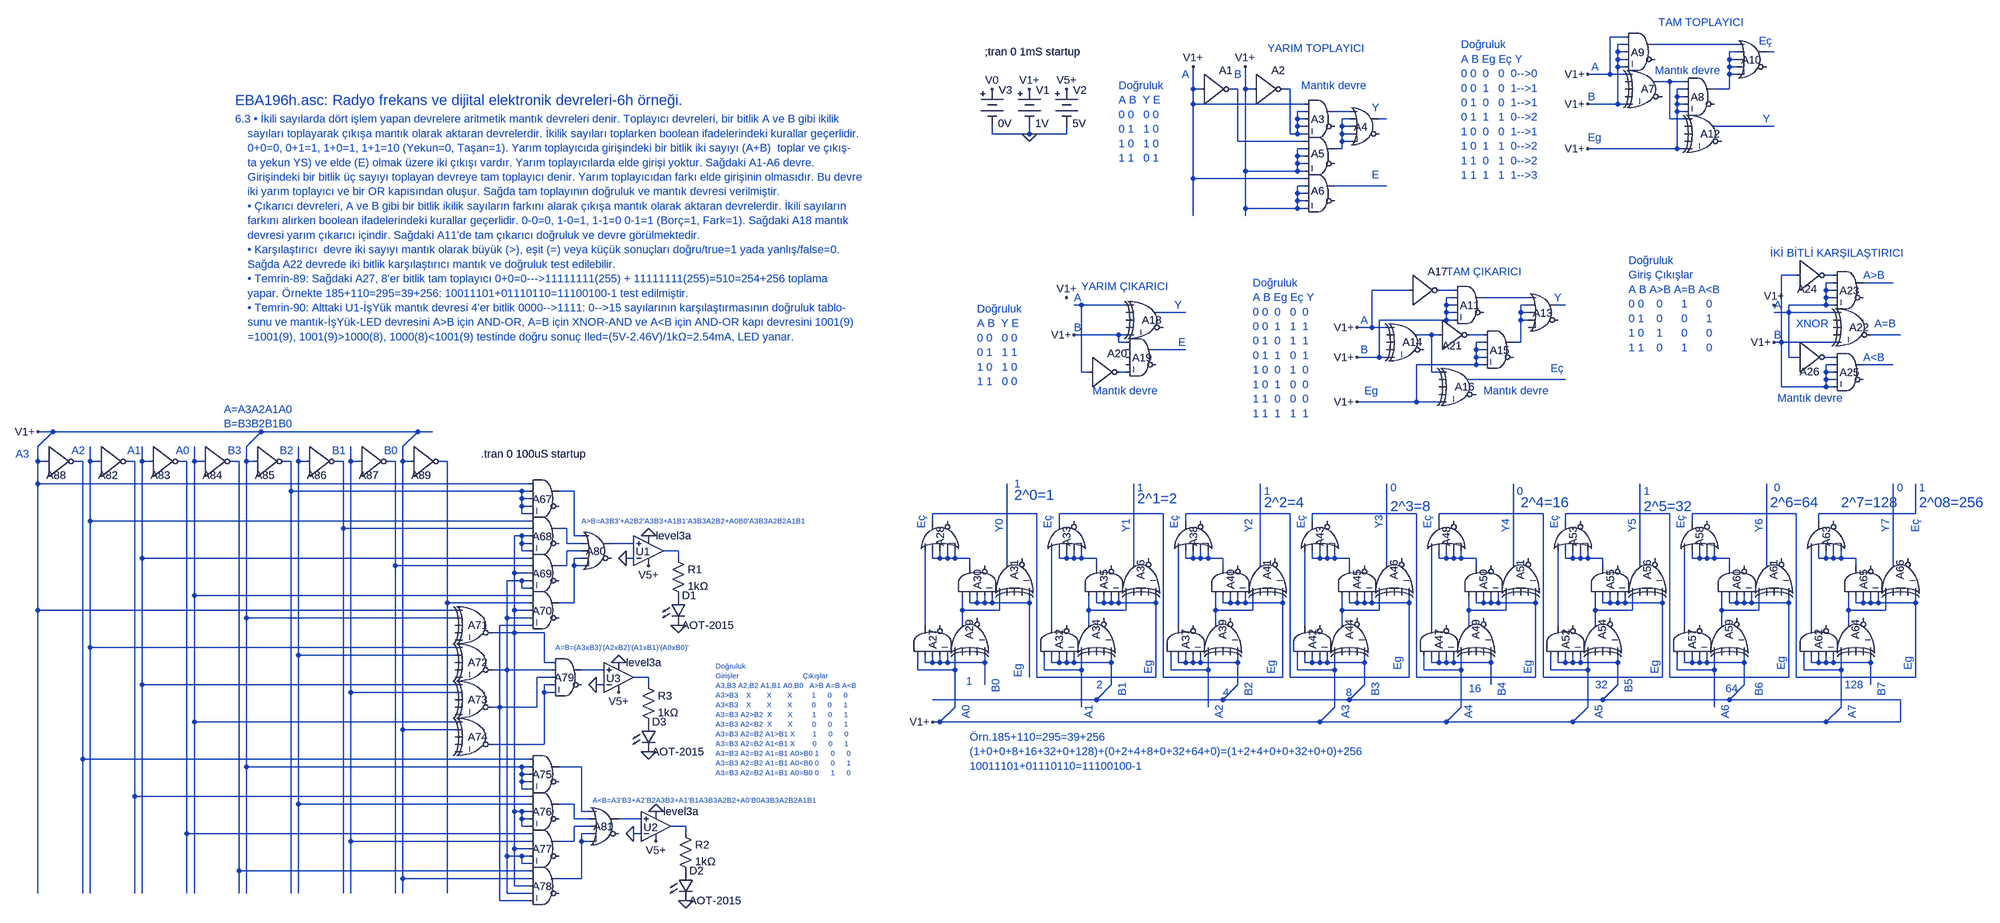
[diagram p0: schematic EBA196h.asc]
EBA196h.asc, the LTspice schematic file:
Version 4
SHEET 1 7064 4332
WIRE 2896 -80 2864 -80
WIRE 2896 -64 2880 -64
WIRE 3136 -64 2960 -64
WIRE 2880 -48 2880 -64
WIRE 2896 -48 2880 -48
WIRE 3136 -48 3120 -48
WIRE 3216 -48 3200 -48
WIRE 2880 -32 2880 -48
WIRE 2896 -32 2880 -32
WIRE 3120 -32 3120 -48
WIRE 3136 -32 3120 -32
WIRE 2880 -16 2880 -32
WIRE 2896 -16 2880 -16
WIRE 3120 -16 3120 -32
WIRE 3136 -16 3120 -16
WIRE 2864 0 2864 -80
WIRE 2864 0 2816 0
WIRE 2896 0 2864 0
WIRE 3120 0 3120 -16
WIRE 3136 0 3120 0
WIRE 2992 16 2960 16
WIRE 3024 16 2992 16
WIRE 1968 32 1968 -16
WIRE 1984 32 1968 32
WIRE 2064 32 2048 32
WIRE 2080 32 2080 -16
WIRE 2096 32 2080 32
WIRE 2176 32 2160 32
WIRE 3024 32 3008 32
WIRE 3120 32 3120 0
WIRE 3120 32 3088 32
WIRE 3008 48 3008 32
WIRE 3024 48 3008 48
WIRE 1968 64 1968 32
WIRE 2208 64 1968 64
WIRE 2880 64 2880 -16
WIRE 2880 64 2816 64
WIRE 2896 64 2880 64
WIRE 3008 64 3008 48
WIRE 3024 64 3008 64
WIRE 2208 80 2192 80
WIRE 2304 80 2272 80
WIRE 3008 80 3008 64
WIRE 3024 80 3008 80
WIRE 2192 96 2192 80
WIRE 2208 96 2192 96
WIRE 2304 96 2288 96
WIRE 2384 96 2368 96
WIRE 2992 96 2992 16
WIRE 3024 96 2992 96
WIRE 2192 112 2192 96
WIRE 2208 112 2192 112
WIRE 2288 112 2288 96
WIRE 2304 112 2288 112
WIRE 3216 112 3088 112
WIRE 1536 128 1536 112
WIRE 1616 128 1616 112
WIRE 1616 128 1536 128
WIRE 1696 128 1696 112
WIRE 1696 128 1616 128
WIRE 2176 128 2176 32
WIRE 2192 128 2192 112
WIRE 2192 128 2176 128
WIRE 2208 128 2192 128
WIRE 2288 128 2288 112
WIRE 2304 128 2288 128
WIRE 2064 144 2064 32
WIRE 2208 144 2064 144
WIRE 2288 144 2288 128
WIRE 2304 144 2288 144
WIRE 2208 160 2192 160
WIRE 2288 160 2288 144
WIRE 2288 160 2272 160
WIRE 3008 160 3008 80
WIRE 3008 160 2816 160
WIRE 3024 160 3008 160
WIRE 2192 176 2192 160
WIRE 2208 176 2192 176
WIRE 2192 192 2192 176
WIRE 2208 192 2192 192
WIRE 2080 208 2080 32
WIRE 2192 208 2192 192
WIRE 2192 208 2080 208
WIRE 2208 208 2192 208
WIRE 1968 224 1968 64
WIRE 2208 224 1968 224
WIRE 2208 240 2192 240
WIRE 2384 240 2272 240
WIRE 2192 256 2192 240
WIRE 2208 256 2192 256
WIRE 2192 272 2192 256
WIRE 2208 272 2192 272
WIRE 2080 288 2080 208
WIRE 2192 288 2192 272
WIRE 2192 288 2080 288
WIRE 2208 288 2192 288
WIRE 1968 304 1968 224
WIRE 2080 304 2080 288
WIRE 3264 432 3232 432
WIRE 3344 432 3328 432
WIRE 3344 448 3328 448
WIRE 3472 448 3408 448
WIRE 2432 464 2352 464
WIRE 2528 464 2496 464
WIRE 3328 464 3328 448
WIRE 3344 464 3328 464
WIRE 2528 480 2512 480
WIRE 2688 480 2592 480
WIRE 3328 480 3328 464
WIRE 3344 480 3328 480
WIRE 1728 496 1712 496
WIRE 1824 496 1728 496
WIRE 2512 496 2512 480
WIRE 2528 496 2512 496
WIRE 2688 496 2672 496
WIRE 2768 496 2752 496
WIRE 3328 496 3328 480
WIRE 3328 496 3248 496
WIRE 3344 496 3328 496
WIRE 1952 512 1888 512
WIRE 2512 512 2512 496
WIRE 2528 512 2512 512
WIRE 2672 512 2672 496
WIRE 2688 512 2672 512
WIRE 3248 512 3248 496
WIRE 3248 512 3216 512
WIRE 3344 512 3248 512
WIRE 2512 528 2512 512
WIRE 2512 528 2368 528
WIRE 2528 528 2512 528
WIRE 2672 528 2672 512
WIRE 2688 528 2672 528
WIRE 2352 544 2352 464
WIRE 2352 544 2320 544
WIRE 2384 544 2352 544
WIRE 1808 560 1712 560
WIRE 1824 560 1808 560
WIRE 2480 560 2448 560
WIRE 2496 560 2480 560
WIRE 2592 560 2560 560
WIRE 3488 560 3424 560
WIRE 1808 576 1808 560
WIRE 1824 576 1808 576
WIRE 2592 576 2576 576
WIRE 2672 576 2672 528
WIRE 2672 576 2656 576
WIRE 3232 576 3232 432
WIRE 3232 576 3216 576
WIRE 3344 576 3232 576
WIRE 1952 592 1888 592
WIRE 2576 592 2576 576
WIRE 2592 592 2576 592
WIRE 2368 608 2368 528
WIRE 2368 608 2320 608
WIRE 2384 608 2368 608
WIRE 2576 608 2576 592
WIRE 2592 608 2576 608
WIRE 3248 608 3248 512
WIRE 3264 608 3248 608
WIRE 3344 608 3328 608
WIRE 2576 624 2576 608
WIRE 2576 624 2448 624
WIRE 2592 624 2576 624
WIRE 3344 624 3328 624
WIRE 3472 624 3408 624
WIRE 1728 640 1728 496
WIRE 1744 640 1728 640
WIRE 1824 640 1808 640
WIRE 2480 640 2480 560
WIRE 2496 640 2480 640
WIRE 3328 640 3328 624
WIRE 3344 640 3328 640
WIRE 2768 656 2560 656
WIRE 3328 656 3328 640
WIRE 3344 656 3328 656
WIRE 3232 672 3232 576
WIRE 3328 672 3328 656
WIRE 3328 672 3232 672
WIRE 3344 672 3328 672
WIRE 2448 704 2448 624
WIRE 2448 704 2320 704
WIRE 2496 704 2448 704
WIRE -624 768 -656 768
WIRE -176 768 -624 768
WIRE 160 768 -176 768
WIRE 192 768 160 768
WIRE -656 800 -624 768
WIRE -208 800 -176 768
WIRE 128 800 160 768
WIRE -656 832 -656 800
WIRE -640 832 -656 832
WIRE -560 832 -576 832
WIRE -544 832 -544 800
WIRE -528 832 -544 832
WIRE -448 832 -464 832
WIRE -432 832 -432 800
WIRE -416 832 -432 832
WIRE -336 832 -352 832
WIRE -320 832 -320 800
WIRE -304 832 -320 832
WIRE -224 832 -240 832
WIRE -208 832 -208 800
WIRE -192 832 -208 832
WIRE -112 832 -128 832
WIRE -96 832 -96 800
WIRE -80 832 -96 832
WIRE 0 832 -16 832
WIRE 16 832 16 800
WIRE 32 832 16 832
WIRE 112 832 96 832
WIRE 128 832 128 800
WIRE 144 832 128 832
WIRE 224 832 208 832
WIRE -656 880 -656 832
WIRE 400 880 -656 880
WIRE -112 896 -112 832
WIRE 384 896 -112 896
WIRE 400 896 384 896
WIRE 496 896 464 896
WIRE 384 912 384 896
WIRE 400 912 384 912
WIRE 384 928 384 912
WIRE 400 928 384 928
WIRE 384 944 384 928
WIRE 400 944 384 944
WIRE 1632 944 1408 944
WIRE 1904 944 1680 944
WIRE 2176 944 1952 944
WIRE 2448 944 2224 944
WIRE 2720 944 2496 944
WIRE 2992 944 2768 944
WIRE 3264 944 3040 944
WIRE 3520 944 3520 880
WIRE 3520 944 3312 944
WIRE -544 960 -544 832
WIRE 400 960 -544 960
WIRE 1408 960 1408 944
WIRE 1680 960 1680 944
WIRE 1952 960 1952 944
WIRE 2224 960 2224 944
WIRE 2496 960 2496 944
WIRE 2768 960 2768 944
WIRE 3040 960 3040 944
WIRE 3312 960 3312 944
WIRE 0 976 0 832
WIRE 400 976 0 976
WIRE 480 976 464 976
WIRE 384 992 368 992
WIRE 400 992 384 992
WIRE 496 992 496 896
WIRE 512 992 496 992
WIRE 384 1008 384 992
WIRE 400 1008 384 1008
WIRE 480 1008 480 976
WIRE 512 1008 480 1008
WIRE 624 1008 576 1008
WIRE 384 1024 384 1008
WIRE 400 1024 384 1024
WIRE 512 1024 480 1024
WIRE 720 1024 688 1024
WIRE -432 1040 -432 832
WIRE 400 1040 -432 1040
WIRE 512 1040 496 1040
WIRE 624 1040 608 1040
WIRE 720 1040 720 1024
WIRE 1408 1040 1408 1024
WIRE 1424 1040 1424 1024
WIRE 1424 1040 1408 1040
WIRE 1440 1040 1440 1024
WIRE 1440 1040 1424 1040
WIRE 1456 1040 1456 1024
WIRE 1456 1040 1440 1040
WIRE 1488 1040 1456 1040
WIRE 1680 1040 1680 1024
WIRE 1696 1040 1696 1024
WIRE 1696 1040 1680 1040
WIRE 1712 1040 1712 1024
WIRE 1712 1040 1696 1040
WIRE 1728 1040 1728 1024
WIRE 1728 1040 1712 1040
WIRE 1760 1040 1728 1040
WIRE 1952 1040 1952 1024
WIRE 1968 1040 1968 1024
WIRE 1968 1040 1952 1040
WIRE 1984 1040 1984 1024
WIRE 1984 1040 1968 1040
WIRE 2000 1040 2000 1024
WIRE 2000 1040 1984 1040
WIRE 2032 1040 2000 1040
WIRE 2224 1040 2224 1024
WIRE 2240 1040 2240 1024
WIRE 2240 1040 2224 1040
WIRE 2256 1040 2256 1024
WIRE 2256 1040 2240 1040
WIRE 2272 1040 2272 1024
WIRE 2272 1040 2256 1040
WIRE 2304 1040 2272 1040
WIRE 2496 1040 2496 1024
WIRE 2512 1040 2512 1024
WIRE 2512 1040 2496 1040
WIRE 2528 1040 2528 1024
WIRE 2528 1040 2512 1040
WIRE 2544 1040 2544 1024
WIRE 2544 1040 2528 1040
WIRE 2576 1040 2544 1040
WIRE 2768 1040 2768 1024
WIRE 2784 1040 2784 1024
WIRE 2784 1040 2768 1040
WIRE 2800 1040 2800 1024
WIRE 2800 1040 2784 1040
WIRE 2816 1040 2816 1024
WIRE 2816 1040 2800 1040
WIRE 2848 1040 2816 1040
WIRE 3040 1040 3040 1024
WIRE 3056 1040 3056 1024
WIRE 3056 1040 3040 1040
WIRE 3072 1040 3072 1024
WIRE 3072 1040 3056 1040
WIRE 3088 1040 3088 1024
WIRE 3088 1040 3072 1040
WIRE 3120 1040 3088 1040
WIRE 3312 1040 3312 1024
WIRE 3328 1040 3328 1024
WIRE 3328 1040 3312 1040
WIRE 3344 1040 3344 1024
WIRE 3344 1040 3328 1040
WIRE 3360 1040 3360 1024
WIRE 3360 1040 3344 1040
WIRE 3392 1040 3360 1040
WIRE 112 1056 112 832
WIRE 400 1056 112 1056
WIRE 480 1056 480 1024
WIRE 480 1056 464 1056
WIRE 496 1056 496 1040
WIRE 512 1056 496 1056
WIRE 1488 1056 1488 1040
WIRE 1568 1056 1568 880
WIRE 1760 1056 1760 1040
WIRE 1840 1056 1840 880
WIRE 2032 1056 2032 1040
WIRE 2112 1056 2112 880
WIRE 2304 1056 2304 1040
WIRE 2384 1056 2384 880
WIRE 2576 1056 2576 1040
WIRE 2656 1056 2656 880
WIRE 2848 1056 2848 1040
WIRE 2928 1056 2928 880
WIRE 3120 1056 3120 1040
WIRE 3200 1056 3200 880
WIRE 3392 1056 3392 1040
WIRE 3472 1056 3472 880
WIRE 368 1072 368 992
WIRE 400 1072 368 1072
WIRE 384 1088 352 1088
WIRE 400 1088 384 1088
WIRE 384 1104 384 1088
WIRE 400 1104 384 1104
WIRE -320 1120 -320 832
WIRE 400 1120 -320 1120
WIRE 224 1136 224 832
WIRE 400 1136 224 1136
WIRE 496 1136 496 1056
WIRE 496 1136 464 1136
WIRE 1488 1136 1488 1120
WIRE 1504 1136 1504 1120
WIRE 1504 1136 1488 1136
WIRE 1520 1136 1520 1120
WIRE 1520 1136 1504 1136
WIRE 1536 1136 1536 1120
WIRE 1536 1136 1520 1136
WIRE 1616 1136 1616 1120
WIRE 1616 1136 1536 1136
WIRE 1760 1136 1760 1120
WIRE 1776 1136 1776 1120
WIRE 1776 1136 1760 1136
WIRE 1792 1136 1792 1120
WIRE 1792 1136 1776 1136
WIRE 1808 1136 1808 1120
WIRE 1808 1136 1792 1136
WIRE 1888 1136 1888 1120
WIRE 1888 1136 1808 1136
WIRE 2032 1136 2032 1120
WIRE 2048 1136 2048 1120
WIRE 2048 1136 2032 1136
WIRE 2064 1136 2064 1120
WIRE 2064 1136 2048 1136
WIRE 2080 1136 2080 1120
WIRE 2080 1136 2064 1136
WIRE 2160 1136 2160 1120
WIRE 2160 1136 2080 1136
WIRE 2304 1136 2304 1120
WIRE 2320 1136 2320 1120
WIRE 2320 1136 2304 1136
WIRE 2336 1136 2336 1120
WIRE 2336 1136 2320 1136
WIRE 2352 1136 2352 1120
WIRE 2352 1136 2336 1136
WIRE 2432 1136 2432 1120
WIRE 2432 1136 2352 1136
WIRE 2576 1136 2576 1120
WIRE 2592 1136 2592 1120
WIRE 2592 1136 2576 1136
WIRE 2608 1136 2608 1120
WIRE 2608 1136 2592 1136
WIRE 2624 1136 2624 1120
WIRE 2624 1136 2608 1136
WIRE 2704 1136 2704 1120
WIRE 2704 1136 2624 1136
WIRE 2848 1136 2848 1120
WIRE 2864 1136 2864 1120
WIRE 2864 1136 2848 1136
WIRE 2880 1136 2880 1120
WIRE 2880 1136 2864 1136
WIRE 2896 1136 2896 1120
WIRE 2896 1136 2880 1136
WIRE 2976 1136 2976 1120
WIRE 2976 1136 2896 1136
WIRE 3120 1136 3120 1120
WIRE 3136 1136 3136 1120
WIRE 3136 1136 3120 1136
WIRE 3152 1136 3152 1120
WIRE 3152 1136 3136 1136
WIRE 3168 1136 3168 1120
WIRE 3168 1136 3152 1136
WIRE 3248 1136 3248 1120
WIRE 3248 1136 3168 1136
WIRE 3392 1136 3392 1120
WIRE 3408 1136 3408 1120
WIRE 3408 1136 3392 1136
WIRE 3424 1136 3424 1120
WIRE 3424 1136 3408 1136
WIRE 3440 1136 3440 1120
WIRE 3440 1136 3424 1136
WIRE 3520 1136 3520 1120
WIRE 3520 1136 3440 1136
WIRE -656 1152 -656 880
WIRE 240 1152 -656 1152
WIRE 368 1152 368 1072
WIRE 400 1152 368 1152
WIRE 1472 1152 1472 1120
WIRE 1552 1152 1552 1120
WIRE 1552 1152 1472 1152
WIRE 1744 1152 1744 1120
WIRE 1824 1152 1824 1120
WIRE 1824 1152 1744 1152
WIRE 2016 1152 2016 1120
WIRE 2096 1152 2096 1120
WIRE 2096 1152 2016 1152
WIRE 2288 1152 2288 1120
WIRE 2368 1152 2368 1120
WIRE 2368 1152 2288 1152
WIRE 2560 1152 2560 1120
WIRE 2640 1152 2640 1120
WIRE 2640 1152 2560 1152
WIRE 2832 1152 2832 1120
WIRE 2912 1152 2912 1120
WIRE 2912 1152 2832 1152
WIRE 3104 1152 3104 1120
WIRE 3184 1152 3184 1120
WIRE 3184 1152 3104 1152
WIRE 3376 1152 3376 1120
WIRE 3456 1152 3456 1120
WIRE 3456 1152 3376 1152
WIRE -208 1168 -208 832
WIRE 240 1168 -208 1168
WIRE 352 1168 352 1088
WIRE 400 1168 352 1168
WIRE 400 1184 336 1184
WIRE 1392 1184 1392 1024
WIRE 1472 1184 1472 1152
WIRE 1664 1184 1664 1024
WIRE 1744 1184 1744 1152
WIRE 1936 1184 1936 1024
WIRE 2016 1184 2016 1152
WIRE 2208 1184 2208 1024
WIRE 2288 1184 2288 1152
WIRE 2480 1184 2480 1024
WIRE 2560 1184 2560 1152
WIRE 2752 1184 2752 1024
WIRE 2832 1184 2832 1152
WIRE 3024 1184 3024 1024
WIRE 3104 1184 3104 1152
WIRE 3296 1184 3296 1024
WIRE 3376 1184 3376 1152
WIRE 368 1200 368 1152
WIRE 368 1200 320 1200
WIRE 432 1200 368 1200
WIRE -544 1232 -544 960
WIRE 240 1232 -544 1232
WIRE -96 1248 -96 832
WIRE 240 1248 -96 1248
WIRE 432 1264 432 1200
WIRE 448 1264 432 1264
WIRE 1392 1264 1392 1248
WIRE 1408 1264 1408 1248
WIRE 1408 1264 1392 1264
WIRE 1424 1264 1424 1248
WIRE 1424 1264 1408 1264
WIRE 1440 1264 1440 1248
WIRE 1440 1264 1424 1264
WIRE 1520 1264 1520 1248
WIRE 1520 1264 1440 1264
WIRE 1664 1264 1664 1248
WIRE 1680 1264 1680 1248
WIRE 1680 1264 1664 1264
WIRE 1696 1264 1696 1248
WIRE 1696 1264 1680 1264
WIRE 1712 1264 1712 1248
WIRE 1712 1264 1696 1264
WIRE 1792 1264 1792 1248
WIRE 1792 1264 1712 1264
WIRE 1936 1264 1936 1248
WIRE 1952 1264 1952 1248
WIRE 1952 1264 1936 1264
WIRE 1968 1264 1968 1248
WIRE 1968 1264 1952 1264
WIRE 1984 1264 1984 1248
WIRE 1984 1264 1968 1264
WIRE 2064 1264 2064 1248
WIRE 2064 1264 1984 1264
WIRE 2208 1264 2208 1248
WIRE 2224 1264 2224 1248
WIRE 2224 1264 2208 1264
WIRE 2240 1264 2240 1248
WIRE 2240 1264 2224 1264
WIRE 2256 1264 2256 1248
WIRE 2256 1264 2240 1264
WIRE 2336 1264 2336 1248
WIRE 2336 1264 2256 1264
WIRE 2480 1264 2480 1248
WIRE 2496 1264 2496 1248
WIRE 2496 1264 2480 1264
WIRE 2512 1264 2512 1248
WIRE 2512 1264 2496 1264
WIRE 2528 1264 2528 1248
WIRE 2528 1264 2512 1264
WIRE 2608 1264 2608 1248
WIRE 2608 1264 2528 1264
WIRE 2752 1264 2752 1248
WIRE 2768 1264 2768 1248
WIRE 2768 1264 2752 1264
WIRE 2784 1264 2784 1248
WIRE 2784 1264 2768 1264
WIRE 2800 1264 2800 1248
WIRE 2800 1264 2784 1264
WIRE 2880 1264 2880 1248
WIRE 2880 1264 2800 1264
WIRE 3024 1264 3024 1248
WIRE 3040 1264 3040 1248
WIRE 3040 1264 3024 1264
WIRE 3056 1264 3056 1248
WIRE 3056 1264 3040 1264
WIRE 3072 1264 3072 1248
WIRE 3072 1264 3056 1264
WIRE 3152 1264 3152 1248
WIRE 3152 1264 3072 1264
WIRE 3296 1264 3296 1248
WIRE 3312 1264 3312 1248
WIRE 3312 1264 3296 1264
WIRE 3328 1264 3328 1248
WIRE 3328 1264 3312 1264
WIRE 3344 1264 3344 1248
WIRE 3344 1264 3328 1264
WIRE 3424 1264 3424 1248
WIRE 3424 1264 3344 1264
WIRE 352 1280 352 1168
WIRE 352 1280 320 1280
WIRE 448 1280 352 1280
WIRE 560 1280 512 1280
WIRE 1376 1280 1376 1248
WIRE 1456 1280 1456 1248
WIRE 1456 1280 1376 1280
WIRE 1648 1280 1648 1248
WIRE 1728 1280 1728 1248
WIRE 1728 1280 1648 1280
WIRE 1920 1280 1920 1248
WIRE 2000 1280 2000 1248
WIRE 2000 1280 1920 1280
WIRE 2192 1280 2192 1248
WIRE 2272 1280 2272 1248
WIRE 2272 1280 2192 1280
WIRE 2464 1280 2464 1248
WIRE 2544 1280 2544 1248
WIRE 2544 1280 2464 1280
WIRE 2736 1280 2736 1248
WIRE 2816 1280 2816 1248
WIRE 2816 1280 2736 1280
WIRE 3008 1280 3008 1248
WIRE 3088 1280 3088 1248
WIRE 3088 1280 3008 1280
WIRE 3280 1280 3280 1248
WIRE 3360 1280 3360 1248
WIRE 3360 1280 3280 1280
WIRE 448 1296 416 1296
WIRE 656 1296 624 1296
WIRE 1616 1296 1616 1136
WIRE 1632 1296 1632 944
WIRE 1888 1296 1888 1136
WIRE 1888 1296 1632 1296
WIRE 1904 1296 1904 944
WIRE 2160 1296 2160 1136
WIRE 2160 1296 1904 1296
WIRE 2176 1296 2176 944
WIRE 2432 1296 2432 1136
WIRE 2432 1296 2176 1296
WIRE 2448 1296 2448 944
WIRE 2704 1296 2704 1136
WIRE 2704 1296 2448 1296
WIRE 2720 1296 2720 944
WIRE 2976 1296 2976 1136
WIRE 2976 1296 2720 1296
WIRE 2992 1296 2992 944
WIRE 3248 1296 3248 1136
WIRE 3248 1296 2992 1296
WIRE 3264 1296 3264 944
WIRE 3520 1296 3520 1136
WIRE 3520 1296 3264 1296
WIRE -432 1312 -432 1040
WIRE 240 1312 -432 1312
WIRE 448 1312 432 1312
WIRE 560 1312 544 1312
WIRE 656 1312 656 1296
WIRE 1520 1312 1520 1264
WIRE 1792 1312 1792 1264
WIRE 2064 1312 2064 1264
WIRE 2336 1312 2336 1264
WIRE 2608 1312 2608 1264
WIRE 2880 1312 2880 1264
WIRE 3152 1312 3152 1264
WIRE 3424 1312 3424 1264
WIRE 16 1328 16 832
WIRE 240 1328 16 1328
WIRE 432 1328 432 1312
WIRE 448 1328 432 1328
WIRE 1760 1344 1792 1312
WIRE 1760 1344 1408 1344
WIRE 2032 1344 2064 1312
WIRE 2032 1344 1760 1344
WIRE 2304 1344 2336 1312
WIRE 2304 1344 2032 1344
WIRE 2848 1344 2880 1312
WIRE 2848 1344 2304 1344
WIRE 3120 1344 3152 1312
WIRE 3120 1344 2848 1344
WIRE 3488 1344 3120 1344
WIRE 336 1360 336 1184
WIRE 336 1360 320 1360
WIRE 416 1360 416 1296
WIRE 416 1360 336 1360
WIRE 1456 1360 1456 1280
WIRE 1728 1360 1728 1280
WIRE 2000 1360 2000 1280
WIRE 2272 1360 2272 1280
WIRE 2544 1360 2544 1280
WIRE 2816 1360 2816 1280
WIRE 3088 1360 3088 1280
WIRE 3360 1360 3360 1280
WIRE -320 1392 -320 1120
WIRE 240 1392 -320 1392
WIRE 1424 1392 1456 1360
WIRE 1424 1392 1408 1392
WIRE 2240 1392 2272 1360
WIRE 2240 1392 1424 1392
WIRE 2512 1392 2544 1360
WIRE 2512 1392 2240 1392
WIRE 2784 1392 2816 1360
WIRE 2784 1392 2512 1392
WIRE 3328 1392 3360 1360
WIRE 3328 1392 2784 1392
WIRE 3488 1392 3488 1344
WIRE 3488 1392 3328 1392
WIRE 128 1408 128 832
WIRE 240 1408 128 1408
WIRE 432 1440 432 1328
WIRE 432 1440 320 1440
WIRE -560 1472 -560 832
WIRE 400 1472 -560 1472
WIRE -208 1488 -208 1168
WIRE 384 1488 -208 1488
WIRE 400 1488 384 1488
WIRE 512 1488 464 1488
WIRE 384 1504 384 1488
WIRE 400 1504 384 1504
WIRE 384 1520 384 1504
WIRE 400 1520 384 1520
WIRE 384 1536 384 1520
WIRE 400 1536 384 1536
WIRE -448 1552 -448 832
WIRE 400 1552 -448 1552
WIRE -96 1568 -96 1248
WIRE 400 1568 -96 1568
WIRE 496 1568 464 1568
WIRE 368 1584 368 1200
WIRE 384 1584 368 1584
WIRE 400 1584 384 1584
WIRE 512 1584 512 1488
WIRE 528 1584 512 1584
WIRE 384 1600 384 1584
WIRE 400 1600 384 1600
WIRE 496 1600 496 1568
WIRE 528 1600 496 1600
WIRE 640 1600 592 1600
WIRE 384 1616 384 1600
WIRE 400 1616 384 1616
WIRE 528 1616 496 1616
WIRE 736 1616 704 1616
WIRE -336 1632 -336 832
WIRE 400 1632 -336 1632
WIRE 528 1632 512 1632
WIRE 640 1632 624 1632
WIRE 736 1632 736 1616
WIRE 16 1648 16 1328
WIRE 400 1648 16 1648
WIRE 496 1648 496 1616
WIRE 496 1648 464 1648
WIRE 512 1648 512 1632
WIRE 528 1648 512 1648
WIRE 368 1664 368 1584
WIRE 400 1664 368 1664
WIRE 352 1680 352 1280
WIRE 384 1680 352 1680
WIRE 400 1680 384 1680
WIRE 384 1696 384 1680
WIRE 400 1696 384 1696
WIRE -224 1712 -224 832
WIRE 400 1712 -224 1712
WIRE 128 1728 128 1408
WIRE 400 1728 128 1728
WIRE 512 1728 512 1648
WIRE 512 1728 464 1728
WIRE 368 1744 368 1664
WIRE 400 1744 368 1744
WIRE -656 1760 -656 1152
WIRE -560 1760 -560 1472
WIRE -544 1760 -544 1232
WIRE -448 1760 -448 1552
WIRE -432 1760 -432 1312
WIRE -336 1760 -336 1632
WIRE -320 1760 -320 1392
WIRE -224 1760 -224 1712
WIRE -208 1760 -208 1488
WIRE -112 1760 -112 896
WIRE -96 1760 -96 1568
WIRE 0 1760 0 976
WIRE 16 1760 16 1648
WIRE 112 1760 112 1056
WIRE 128 1760 128 1728
WIRE 224 1760 224 1136
WIRE 352 1760 352 1680
WIRE 400 1760 352 1760
WIRE 336 1776 336 1360
WIRE 400 1776 336 1776
FLAG 1616 32 V1+
FLAG 1696 32 V5+
FLAG 1616 128 0
FLAG 1536 32 V0
FLAG 1968 -16 V1+
FLAG 2080 -16 V1+
FLAG 2816 0 V1+
FLAG 2816 64 V1+
FLAG 2816 160 V1+
FLAG 1696 480 V1+
FLAG 1712 560 V1+
FLAG 2320 544 V1+
FLAG 2320 608 V1+
FLAG 2320 704 V1+
FLAG 3216 496 V1+
FLAG 3216 576 V1+
FLAG 1408 1392 V1+
FLAG -656 768 V1+
FLAG 656 992 0
FLAG 656 1056 V5+
FLAG 608 1040 0
FLAG 672 1584 0
FLAG 672 1648 V5+
FLAG 624 1632 0
FLAG 736 1776 0
FLAG 592 1264 0
FLAG 592 1328 V5+
FLAG 544 1312 0
FLAG 720 1184 0
FLAG 656 1456 0
SYMBOL Misc\\battery 1616 16 R0
WINDOW 0 14 18 Left 2
WINDOW 3 13 90 Left 2
SYMATTR InstName V1
SYMATTR Value 1V
SYMBOL Misc\\battery 1696 16 R0
WINDOW 0 14 18 Left 2
WINDOW 3 13 90 Left 2
SYMATTR InstName V2
SYMATTR Value 5V
SYMBOL Misc\\battery 1536 16 R0
WINDOW 0 14 18 Left 2
WINDOW 3 13 90 Left 2
SYMATTR InstName V3
SYMATTR Value 0V
SYMBOL Digital\\inv 1984 -32 R0
SYMATTR InstName A1
SYMBOL Digital\\inv 2096 -32 R0
SYMATTR InstName A2
SYMBOL Digital\\and 2240 32 R0
WINDOW 0 -19 65 Left 2
SYMATTR InstName A3
SYMBOL Digital\\or 2336 48 R0
WINDOW 0 -22 65 Left 2
SYMATTR InstName A4
SYMBOL Digital\\and 2240 112 R0
WINDOW 0 -19 59 Left 2
SYMATTR InstName A5
SYMBOL Digital\\and 2240 192 R0
WINDOW 0 -19 59 Left 2
SYMATTR InstName A6
SYMBOL Digital\\and 2928 -112 R0
WINDOW 0 -19 65 Left 2
SYMATTR InstName A9
SYMBOL Digital\\or 3168 -96 R0
WINDOW 0 -22 65 Left 2
SYMATTR InstName A10
SYMBOL Digital\\xor 2944 -32 R0
WINDOW 0 -14 64 Left 2
SYMATTR InstName A7
SYMBOL Digital\\and 3056 -16 R0
WINDOW 0 -19 65 Left 2
SYMATTR InstName A8
SYMBOL Digital\\xor 3072 64 R0
WINDOW 0 -14 64 Left 2
SYMATTR InstName A12
SYMBOL Digital\\xor 1872 464 R0
WINDOW 0 -14 64 Left 2
SYMATTR InstName A18
SYMBOL Digital\\and 1856 544 R0
WINDOW 0 -19 65 Left 2
SYMATTR InstName A19
SYMBOL Digital\\inv 1744 576 R0
SYMATTR InstName A20
SYMBOL Digital\\and 2560 432 R0
WINDOW 0 -19 65 Left 2
SYMATTR InstName A11
SYMBOL Digital\\or 2720 448 R0
WINDOW 0 -22 65 Left 2
SYMATTR InstName A13
SYMBOL Digital\\xor 2432 512 R0
WINDOW 0 -14 64 Left 2
SYMATTR InstName A14
SYMBOL Digital\\and 2624 528 R0
WINDOW 0 -19 65 Left 2
SYMATTR InstName A15
SYMBOL Digital\\xor 2544 608 R0
WINDOW 0 -14 64 Left 2
SYMATTR InstName A16
SYMBOL Digital\\inv 2432 400 R0
SYMATTR InstName A17
SYMBOL Digital\\inv 2496 496 R0
WINDOW 0 7 87 Left 2
SYMATTR InstName A21
SYMBOL Digital\\xor 3392 480 R0
WINDOW 0 -14 64 Left 2
SYMATTR InstName A22
SYMBOL Digital\\and 3376 400 R0
WINDOW 0 -19 65 Left 2
SYMATTR InstName A23
SYMBOL Digital\\inv 3264 368 R0
WINDOW 0 2 94 Left 2
SYMATTR InstName A24
SYMBOL Digital\\and 3376 576 R0
WINDOW 0 -19 65 Left 2
SYMATTR InstName A25
SYMBOL Digital\\inv 3264 544 R0
WINDOW 0 7 95 Left 2
SYMATTR InstName A26
SYMBOL Digital\\and 1344 1216 R270
WINDOW 0 -19 65 Left 2
SYMATTR InstName A27
SYMBOL Digital\\or 1360 992 R270
WINDOW 0 -22 65 Left 2
SYMATTR InstName A28
SYMBOL Digital\\xor 1424 1200 R270
WINDOW 0 -14 64 Left 2
SYMATTR InstName A29
SYMBOL Digital\\and 1440 1088 R270
WINDOW 0 -19 65 Left 2
SYMATTR InstName A30
SYMBOL Digital\\xor 1520 1072 R270
WINDOW 0 -14 64 Left 2
SYMATTR InstName A31
SYMBOL Digital\\and 1616 1216 R270
WINDOW 0 -19 65 Left 2
SYMATTR InstName A32
SYMBOL Digital\\or 1632 992 R270
WINDOW 0 -22 65 Left 2
SYMATTR InstName A33
SYMBOL Digital\\xor 1696 1200 R270
WINDOW 0 -14 64 Left 2
SYMATTR InstName A34
SYMBOL Digital\\and 1712 1088 R270
WINDOW 0 -19 65 Left 2
SYMATTR InstName A35
SYMBOL Digital\\xor 1792 1072 R270
WINDOW 0 -14 64 Left 2
SYMATTR InstName A36
SYMBOL Digital\\and 1888 1216 R270
WINDOW 0 -19 65 Left 2
SYMATTR InstName A37
SYMBOL Digital\\or 1904 992 R270
WINDOW 0 -22 65 Left 2
SYMATTR InstName A38
SYMBOL Digital\\xor 1968 1200 R270
WINDOW 0 -14 64 Left 2
SYMATTR InstName A39
SYMBOL Digital\\and 1984 1088 R270
WINDOW 0 -19 65 Left 2
SYMATTR InstName A40
SYMBOL Digital\\xor 2064 1072 R270
WINDOW 0 -14 64 Left 2
SYMATTR InstName A41
SYMBOL Digital\\and 2160 1216 R270
WINDOW 0 -19 65 Left 2
SYMATTR InstName A42
SYMBOL Digital\\or 2176 992 R270
WINDOW 0 -22 65 Left 2
SYMATTR InstName A43
SYMBOL Digital\\xor 2240 1200 R270
WINDOW 0 -14 64 Left 2
SYMATTR InstName A44
SYMBOL Digital\\and 2256 1088 R270
WINDOW 0 -19 65 Left 2
SYMATTR InstName A45
SYMBOL Digital\\xor 2336 1072 R270
WINDOW 0 -14 64 Left 2
SYMATTR InstName A46
SYMBOL Digital\\and 2432 1216 R270
WINDOW 0 -19 65 Left 2
SYMATTR InstName A47
SYMBOL Digital\\or 2448 992 R270
WINDOW 0 -22 65 Left 2
SYMATTR InstName A48
SYMBOL Digital\\xor 2512 1200 R270
WINDOW 0 -14 64 Left 2
SYMATTR InstName A49
SYMBOL Digital\\and 2528 1088 R270
WINDOW 0 -19 65 Left 2
SYMATTR InstName A50
SYMBOL Digital\\xor 2608 1072 R270
WINDOW 0 -14 64 Left 2
SYMATTR InstName A51
SYMBOL Digital\\and 2704 1216 R270
WINDOW 0 -19 65 Left 2
SYMATTR InstName A52
SYMBOL Digital\\or 2720 992 R270
WINDOW 0 -22 65 Left 2
SYMATTR InstName A53
SYMBOL Digital\\xor 2784 1200 R270
WINDOW 0 -14 64 Left 2
SYMATTR InstName A54
SYMBOL Digital\\and 2800 1088 R270
WINDOW 0 -19 65 Left 2
SYMATTR InstName A55
SYMBOL Digital\\xor 2880 1072 R270
WINDOW 0 -14 64 Left 2
SYMATTR InstName A56
SYMBOL Digital\\and 2976 1216 R270
WINDOW 0 -19 65 Left 2
SYMATTR InstName A57
SYMBOL Digital\\or 2992 992 R270
WINDOW 0 -22 65 Left 2
SYMATTR InstName A58
SYMBOL Digital\\xor 3056 1200 R270
WINDOW 0 -14 64 Left 2
SYMATTR InstName A59
SYMBOL Digital\\and 3072 1088 R270
WINDOW 0 -19 65 Left 2
SYMATTR InstName A60
SYMBOL Digital\\xor 3152 1072 R270
WINDOW 0 -14 64 Left 2
SYMATTR InstName A61
SYMBOL Digital\\and 3248 1216 R270
WINDOW 0 -19 65 Left 2
SYMATTR InstName A62
SYMBOL Digital\\or 3264 992 R270
WINDOW 0 -22 65 Left 2
SYMATTR InstName A63
SYMBOL Digital\\xor 3328 1200 R270
WINDOW 0 -14 64 Left 2
SYMATTR InstName A64
SYMBOL Digital\\and 3344 1088 R270
WINDOW 0 -19 65 Left 2
SYMATTR InstName A65
SYMBOL Digital\\xor 3424 1072 R270
WINDOW 0 -14 64 Left 2
SYMATTR InstName A66
SYMBOL Digital\\and 432 848 R0
WINDOW 0 -26 65 Left 2
SYMATTR InstName A67
SYMBOL Digital\\and 432 928 R0
WINDOW 0 -26 65 Left 2
SYMATTR InstName A68
SYMBOL Digital\\and 432 1008 R0
WINDOW 0 -26 65 Left 2
SYMATTR InstName A69
SYMBOL Digital\\and 432 1088 R0
WINDOW 0 -26 65 Left 2
SYMATTR InstName A70
SYMBOL Digital\\xor 288 1120 R0
WINDOW 0 -20 64 Left 2
SYMATTR InstName A71
SYMBOL Digital\\xor 288 1200 R0
WINDOW 0 -20 64 Left 2
SYMATTR InstName A72
SYMBOL Digital\\xor 288 1280 R0
WINDOW 0 -20 64 Left 2
SYMATTR InstName A73
SYMBOL Digital\\xor 288 1360 R0
WINDOW 0 -20 64 Left 2
SYMATTR InstName A74
SYMBOL Digital\\and 432 1440 R0
WINDOW 0 -26 65 Left 2
SYMATTR InstName A75
SYMBOL Digital\\and 432 1520 R0
WINDOW 0 -26 65 Left 2
SYMATTR InstName A76
SYMBOL Digital\\and 432 1600 R0
WINDOW 0 -26 65 Left 2
SYMATTR InstName A77
SYMBOL Digital\\and 432 1680 R0
WINDOW 0 -26 65 Left 2
SYMATTR InstName A78
SYMBOL Digital\\and 480 1232 R0
WINDOW 0 -26 65 Left 2
SYMATTR InstName A79
SYMBOL Digital\\or 544 960 R0
WINDOW 0 -22 65 Left 2
SYMATTR InstName A80
SYMBOL Digital\\or 560 1552 R0
WINDOW 0 -22 65 Left 2
SYMATTR InstName A81
SYMBOL Digital\\inv -528 768 R0
WINDOW 0 2 94 Left 2
SYMATTR InstName A82
SYMBOL Digital\\inv -416 768 R0
WINDOW 0 2 94 Left 2
SYMATTR InstName A83
SYMBOL Digital\\inv -304 768 R0
WINDOW 0 2 94 Left 2
SYMATTR InstName A84
SYMBOL Digital\\inv -192 768 R0
WINDOW 0 2 94 Left 2
SYMATTR InstName A85
SYMBOL Digital\\inv -80 768 R0
WINDOW 0 2 94 Left 2
SYMATTR InstName A86
SYMBOL Digital\\inv 32 768 R0
WINDOW 0 2 94 Left 2
SYMATTR InstName A87
SYMBOL OpAmps\\UniversalOpAmp3 656 1024 M180
WINDOW 0 -27 -2 Left 2
SYMATTR InstName U1
SYMBOL res 704 1024 R0
SYMATTR InstName R1
SYMATTR Value 1kΩ
SYMBOL LED 704 1120 R0
SYMATTR InstName D1
SYMATTR Value AOT-2015
SYMATTR Description Diode
SYMATTR Type diode
SYMBOL OpAmps\\UniversalOpAmp3 672 1616 M180
WINDOW 0 -27 -2 Left 2
SYMATTR InstName U2
SYMBOL res 720 1616 R0
SYMATTR InstName R2
SYMATTR Value 1kΩ
SYMBOL LED 720 1712 R0
SYMATTR InstName D2
SYMATTR Value AOT-2015
SYMATTR Description Diode
SYMATTR Type diode
SYMBOL Digital\\inv -640 768 R0
WINDOW 0 2 94 Left 2
SYMATTR InstName A88
SYMBOL Digital\\inv 144 768 R0
WINDOW 0 2 94 Left 2
SYMATTR InstName A89
SYMBOL OpAmps\\UniversalOpAmp3 592 1296 M180
WINDOW 0 -27 -2 Left 2
SYMATTR InstName U3
SYMBOL res 640 1296 R0
SYMATTR InstName R3
SYMATTR Value 1kΩ
SYMBOL LED 640 1392 R0
SYMATTR InstName D3
SYMATTR Value AOT-2015
SYMATTR Description Diode
SYMATTR Type diode
TEXT -232 56 Left 3 ;EBA196h.asc: Radyo frekans ve dijital elektronik devreleri-6h örneği.
TEXT -232 96 Left 2 ;6.3 • İkili sayılarda dört işlem yapan devrelere aritmetik mantık devreleri denir. Toplayıcı devreleri, bir bitlik A ve B gibi ikilik \n    sayıları toplayarak çıkışa mantık olarak aktaran devrelerdir. İkilik sayıları toplarken boolean ifadelerindeki kurallar geçerlidir.\n    0+0=0, 0+1=1, 1+0=1, 1+1=10 (Yekun=0, Taşan=1). Yarım toplayıcıda girişindeki bir bitlik iki sayıyı (A+B)  toplar ve çıkış-\n    ta yekun YS) ve elde (E) olmak üzere iki çıkışı vardır. Yarım toplayıcılarda elde girişi yoktur. Sağdaki A1-A6 devre.\n    Girişindeki bir bitlik üç sayıyı toplayan devreye tam toplayıcı denir. Yarım toplayıcıdan farkı elde girişinin olmasıdır. Bu devre\n    iki yarım toplayıcı ve bir OR kapısından oluşur. Sağda tam toplayının doğruluk ve mantık devresi verilmiştir.\n    • Çıkarıcı devreleri, A ve B gibi bir bitlik ikilik sayıların farkını alarak çıkışa mantık olarak aktaran devrelerdir. İkili sayıların\n    farkını alırken boolean ifadelerindeki kurallar geçerlidir. 0-0=0, 1-0=1, 1-1=0 0-1=1 (Borç=1, Fark=1). Sağdaki A18 mantık\n    devresi yarım çıkarıcı içindir. Sağdaki A11'de tam çıkarıcı doğruluk ve devre görülmektedir.\n    • Karşılaştırıcı  devre iki sayıyı mantık olarak büyük (>), eşit (=) veya küçük sonuçları doğru/true=1 yada yanlış/false=0.\n    Sağda A22 devrede iki bitlik karşılaştırıcı mantık ve doğruluk test edilebilir.\n    • Temrin-89: Sağdaki A27, 8'er bitlik tam toplayıcı 0+0=0--->11111111(255) + 11111111(255)=510=254+256 toplama \n    yapar. Örnekte 185+110=295=39+256: 10011101+01110110=11100100-1 test edilmiştir.\n    • Temrin-90: Alttaki U1-İşYük mantık devresi 4'er bitlik 0000-->1111: 0-->15 sayılarının karşılaştırmasının doğruluk tablo-\n    sunu ve mantık-İşYük-LED devresini A>B için AND-OR, A=B için XNOR-AND ve A<B için AND-OR kapı devresini 1001(9)\n    =1001(9), 1001(9)>1000(8), 1000(8)<1001(9) testinde doğru sonuç Iled=(5V-2.46V)/1kΩ=2.54mA, LED yanar.
TEXT 1520 -48 Left 2 !;tran 0 1mS startup
TEXT 1808 24 Left 2 ;Doğruluk\nA B  Y E\n0 0   0 0\n0 1   1 0\n1 0   1 0\n1 1   0 1
TEXT 1944 0 Left 2 ;A
TEXT 2056 0 Left 2 ;B
TEXT 2352 72 Left 2 ;Y
TEXT 2352 216 Left 2 ;E
TEXT 2200 24 Left 2 ;Mantık devre
TEXT 2128 -56 Left 2 ;YARIM TOPLAYICI
TEXT 2544 -64 Left 2 ;Doğruluk\nA B Eg Eç Y\n0 0  0   0  0-->0\n0 0  1   0  1-->1\n0 1  0   0  1-->1\n0 1  1   1  0-->2\n1 0  0   0  1-->1\n1 0  1   1  0-->2\n1 1  0   1  0-->2\n1 1  1   1  1-->3
TEXT 3192 96 Left 2 ;Y
TEXT 2960 -8 Left 2 ;Mantık devre
TEXT 2968 -112 Left 2 ;TAM TOPLAYICI
TEXT 2824 -16 Left 2 ;A
TEXT 2816 48 Left 2 ;B
TEXT 2816 136 Left 2 ;Eg
TEXT 3184 -72 Left 2 ;Eç
TEXT 1504 504 Left 2 ;Doğruluk\nA B  Y E\n0 0   0 0\n0 1   1 1\n1 0   1 0\n1 1   0 0
TEXT 1752 680 Left 2 ;Mantık devre
TEXT 1728 456 Left 2 ;YARIM ÇIKARICI
TEXT 1712 480 Left 2 ;A
TEXT 1712 544 Left 2 ;B
TEXT 1928 496 Left 2 ;Y
TEXT 1936 576 Left 2 ;E
TEXT 2096 448 Left 2 ;Doğruluk\nA B Eg Eç Y\n0 0  0   0  0\n0 0  1   1  1\n0 1  0   1  1\n0 1  1   0  1\n1 0  0   1  0\n1 0  1   0  0\n1 1  0   0  0\n1 1  1   1  1
TEXT 2744 480 Left 2 ;Y
TEXT 2592 680 Left 2 ;Mantık devre
TEXT 2512 424 Left 2 ;TAM ÇIKARICI
TEXT 2328 528 Left 2 ;A
TEXT 2328 592 Left 2 ;B
TEXT 2336 680 Left 2 ;Eg
TEXT 2736 632 Left 2 ;Eç
TEXT 2904 400 Left 2 ;Doğruluk\nGiriş Çıkışlar\nA B A>B A=B A<B\n0 0    0      1      0\n0 1    0      0      1\n1 0    1      0      0\n1 1    0      1      0
TEXT 3224 696 Left 2 ;Mantık devre
TEXT 3208 384 Left 2 ;İKİ BİTLİ KARŞILAŞTIRICI
TEXT 3216 496 Left 2 ;A
TEXT 3216 560 Left 2 ;B
TEXT 3432 536 Left 2 ;A=B
TEXT 3408 432 Left 2 ;A>B
TEXT 3408 608 Left 2 ;A<B
TEXT 3264 536 Left 2 ;XNOR
TEXT 1552 984 VLeft 2 ;Y0
TEXT 1480 1384 VLeft 2 ;A0
TEXT 1544 1328 VLeft 2 ;B0
TEXT 1592 1296 VLeft 2 ;Eg
TEXT 1384 976 VLeft 2 ;Eç
TEXT 1824 984 VLeft 2 ;Y1
TEXT 1744 1384 VLeft 2 ;A1
TEXT 1816 1336 VLeft 2 ;B1
TEXT 1872 1288 VLeft 2 ;Eg
TEXT 1656 976 VLeft 2 ;Eç
TEXT 2088 984 VLeft 2 ;Y2
TEXT 2024 1384 VLeft 2 ;A2
TEXT 2088 1336 VLeft 2 ;B2
TEXT 2136 1288 VLeft 2 ;Eg
TEXT 1928 976 VLeft 2 ;Eç
TEXT 2368 976 VLeft 2 ;Y3
TEXT 2296 1384 VLeft 2 ;A3
TEXT 2360 1336 VLeft 2 ;B3
TEXT 2408 1280 VLeft 2 ;Eg
TEXT 2200 976 VLeft 2 ;Eç
TEXT 2640 984 VLeft 2 ;Y4
TEXT 2560 1384 VLeft 2 ;A4
TEXT 2632 1336 VLeft 2 ;B4
TEXT 2688 1288 VLeft 2 ;Eg
TEXT 2472 976 VLeft 2 ;Eç
TEXT 2912 984 VLeft 2 ;Y5
TEXT 2840 1384 VLeft 2 ;A5
TEXT 2904 1328 VLeft 2 ;B5
TEXT 2960 1288 VLeft 2 ;Eg
TEXT 2744 976 VLeft 2 ;Eç
TEXT 3184 984 VLeft 2 ;Y6
TEXT 3112 1384 VLeft 2 ;A6
TEXT 3184 1336 VLeft 2 ;B6
TEXT 3232 1280 VLeft 2 ;Eg
TEXT 3016 976 VLeft 2 ;Eç
TEXT 3456 984 VLeft 2 ;Y7
TEXT 3384 1384 VLeft 2 ;A7
TEXT 3448 1336 VLeft 2 ;B7
TEXT 3504 1280 VLeft 2 ;Eg
TEXT 3520 984 VLeft 2 ;Eç
TEXT 1584 904 Left 3 ;2^0=1
TEXT 1848 912 Left 3 ;2^1=2
TEXT 2120 920 Left 3 ;2^2=4
TEXT 2392 928 Left 3 ;2^3=8
TEXT 2672 920 Left 3 ;2^4=16
TEXT 2936 928 Left 3 ;2^5=32
TEXT 3208 920 Left 3 ;2^6=64
TEXT 3360 920 Left 3 ;2^7=128
TEXT 3528 920 Left 3 ;2^08=256
TEXT 1480 1304 Left 2 ;1
TEXT 1760 1312 Left 2 ;2
TEXT 2032 1328 Left 2 ;4
TEXT 2296 1328 Left 2 ;8
TEXT 2560 1320 Left 2 ;16
TEXT 2832 1312 Left 2 ;32
TEXT 3112 1320 Left 2 ;64
TEXT 3368 1312 Left 2 ;128
TEXT 1488 1424 Left 2 ;Örn.185+110=295=39+256\n(1+0+0+8+16+32+0+128)+(0+2+4+8+0+32+64+0)=(1+2+4+0+0+32+0+0)+256\n10011101+01110110=11100100-1
TEXT 2120 896 Left 2 ;1
TEXT 2392 888 Left 2 ;0
TEXT 2664 896 Left 2 ;0
TEXT 2936 896 Left 2 ;1
TEXT 3528 888 Left 2 ;1
TEXT 3480 888 Left 2 ;0
TEXT 3216 888 Left 2 ;0
TEXT 1848 888 Left 2 ;1
TEXT 1584 880 Left 2 ;1
TEXT 800 1272 Left 1 ;Doğruluk\nGirişler                                 Çıkışlar\nA3,B3 A2,B2 A1,B1 A0,B0   A>B A=B A<B\nA3>B3    X        X        X          1      0      0\nA3<B3    X        X        X          0      0      1\nA3=B3 A2>B2  X        X          1      0      1\nA3=B3 A2<B2  X        X          0      0      1\nA3=B3 A2=B2 A1>B1 X         1      0      0\nA3=B3 A2=B2 A1<B1 X         0      0      1\nA3=B3 A2=B2 A1=B1 A0>B0 1      0      0\nA3=B3 A2=B2 A1=B1 A0<B0 0      0      1\nA3=B3 A2=B2 A1=B1 A0=B0 0      1      0
TEXT -584 808 Left 2 ;A2
TEXT -464 808 Left 2 ;A1
TEXT -360 808 Left 2 ;A0
TEXT -248 808 Left 2 ;B3
TEXT -136 808 Left 2 ;B2
TEXT -24 808 Left 2 ;B1
TEXT 88 808 Left 2 ;B0
TEXT 456 1232 Left 1 ;A=B=(A3xB3)'(A2xB2)'(A1xB1)'(A0xB0)'
TEXT 512 960 Left 1 ;A>B=A3B3'+A2B2'A3B3+A1B1'A3B3A2B2+A0B0'A3B3A2B2A1B1
TEXT 536 1560 Left 1 ;A<B=A3'B3+A2'B2A3B3+A1'B1A3B3A2B2+A0'B0A3B3A2B2A1B1
TEXT -256 720 Left 2 ;A=A3A2A1A0\nB=B3B2B1B0
TEXT -704 816 Left 2 ;A3
TEXT 296 816 Left 2 !.tran 0 100uS startup

The netlist it stands for:
* EBA196h.asc
V1 V1+ 0 1V
V2 V5+ 0 5V
V3 V0 0 0V
A1 V1+ 0 0 0 0 N005 0 0 BUF
A2 V1+ 0 0 0 0 N006 0 0 BUF
A3 V1+ N006 N006 N006 N006 0 N007 0 AND
A4 N007 N008 N008 N008 N008 0 N009 0 OR
A5 N005 V1+ V1+ V1+ V1+ 0 N008 0 AND
A6 V1+ V1+ V1+ V1+ V1+ 0 N011 0 AND
A9 V1+ V1+ V1+ V1+ V1+ 0 N001 0 AND
A10 N001 N002 N002 N002 N002 0 N003 0 OR
A7 V1+ 0 0 0 V1+ 0 N004 0 XOR
A8 N004 V1+ V1+ V1+ V1+ 0 N002 0 AND
A12 N004 0 0 0 V1+ 0 N010 0 XOR
A18 N017 0 0 0 V1+ 0 N020 0 XOR
A19 V1+ 0 0 0 N027 0 N024 0 AND
A20 N017 0 0 0 0 N027 0 0 BUF
A11 N015 V1+ V1+ V1+ V1+ 0 N016 0 AND
A13 N016 N018 N018 N018 0 0 N019 0 OR
A14 V1+ 0 0 0 V1+ 0 N021 0 XOR
A15 N022 V1+ V1+ V1+ V1+ 0 N018 0 AND
A16 N021 0 0 0 V1+ 0 N028 0 XOR
A17 V1+ 0 0 0 0 N015 0 0 BUF
A21 N021 0 0 0 0 N022 0 0 BUF
A22 N013 0 0 0 V1+ N023 0 0 XOR
A23 N012 N013 N013 N013 N013 0 N014 0 AND
A24 V1+ 0 0 0 0 N012 0 0 BUF
A25 N025 V1+ V1+ V1+ V1+ 0 N026 0 AND
A26 N013 0 0 0 0 N025 0 0 BUF
A27 V1+ N092 N092 N092 N092 0 N084 0 AND
A28 N084 N057 N057 N057 N057 0 N043 0 OR
A29 V1+ 0 0 0 N092 0 N075 0 XOR
A30 N075 N074 N074 N074 N074 0 N057 0 AND
A31 N075 0 0 0 N074 0 N065 0 XOR
A32 N096 V1+ V1+ V1+ V1+ 0 N085 0 AND
A33 N085 N058 N058 N058 N058 0 N044 0 OR
A34 N096 0 0 0 V1+ 0 N076 0 XOR
A35 N076 N043 N043 N043 N043 0 N058 0 AND
A36 N076 0 0 0 N043 0 N066 0 XOR
A37 N097 V1+ V1+ V1+ V1+ 0 N086 0 AND
A38 N086 N059 N059 N059 N059 0 N045 0 OR
A39 N097 0 0 0 V1+ 0 N077 0 XOR
A40 N077 N044 N044 N044 N044 0 N059 0 AND
A41 N077 0 0 0 N044 0 N067 0 XOR
A42 V1+ V1+ V1+ V1+ V1+ 0 N087 0 AND
A43 N087 N060 N060 N060 N060 0 N046 0 OR
A44 V1+ 0 0 0 V1+ 0 N078 0 XOR
A45 N078 N045 N045 N045 N045 0 N060 0 AND
A46 N078 0 0 0 N045 0 N068 0 XOR
A47 V1+ N093 N093 N093 N093 0 N088 0 AND
A48 N088 N061 N061 N061 N061 0 N047 0 OR
A49 V1+ 0 0 0 N093 0 N079 0 XOR
A50 N079 N046 N046 N046 N046 0 N061 0 AND
A51 N079 0 0 0 N046 0 N069 0 XOR
A52 V1+ V1+ V1+ V1+ V1+ 0 N089 0 AND
A53 N089 N062 N062 N062 N062 0 N048 0 OR
A54 V1+ 0 0 0 V1+ 0 N080 0 XOR
A55 N080 N047 N047 N047 N047 0 N062 0 AND
A56 N080 0 0 0 N047 0 N070 0 XOR
A57 N098 V1+ V1+ V1+ V1+ 0 N090 0 AND
A58 N090 N063 N063 N063 N063 0 N049 0 OR
A59 N098 0 0 0 V1+ 0 N081 0 XOR
A60 N081 N048 N048 N048 N048 0 N063 0 AND
A61 N081 0 0 0 N048 0 N071 0 XOR
A62 V1+ N094 N094 N094 N094 0 N091 0 AND
A63 N091 N064 N064 N064 N064 0 N050 0 OR
A64 V1+ 0 0 0 N094 0 N082 0 XOR
A65 N082 N049 N049 N049 N049 0 N064 0 AND
A66 N082 0 0 0 N049 0 N072 0 XOR
A67 V1+ N036 N036 N036 N036 0 N042 0 AND
A68 N030 N038 N052 N052 N052 0 N051 0 AND
A69 N032 N040 N052 N073 N073 0 N054 0 AND
A70 N034 N041 N052 N073 N083 0 N056 0 AND
A71 V1+ V1+ 0 0 0 N052 0 0 XOR
A72 N030 N037 0 0 0 N073 0 0 XOR
A73 N032 N039 0 0 0 N083 0 0 XOR
A74 N034 V1+ 0 0 0 N100 0 0 XOR
A75 N029 V1+ V1+ V1+ V1+ 0 N101 0 AND
A76 N031 N037 N052 N052 N052 0 N102 0 AND
A77 N033 N039 N052 N073 N073 0 N104 0 AND
A78 N035 V1+ N052 N073 N083 0 N106 0 AND
A79 N052 N073 N083 N100 N100 0 N095 0 AND
A80 N042 N051 N054 N056 N056 0 N053 0 OR
A81 N101 N102 N104 N106 N106 0 N103 0 OR
A82 N030 0 0 0 0 N031 0 0 BUF
A83 N032 0 0 0 0 N033 0 0 BUF
A84 N034 0 0 0 0 N035 0 0 BUF
A85 V1+ 0 0 0 0 N036 0 0 BUF
A86 N037 0 0 0 0 N038 0 0 BUF
A87 N039 0 0 0 0 N040 0 0 BUF
XU1 N053 0 V5+ 0 N055 level3a  ; pins In+ In- V+ V- OUT
R1 N055 P001 1kΩ
D1 P001 0 AOT-2015
XU2 N103 0 V5+ 0 N105 level3a  ; pins In+ In- V+ V- OUT
R2 N105 P002 1kΩ
D2 P002 0 AOT-2015
A88 V1+ 0 0 0 0 N029 0 0 BUF
A89 V1+ 0 0 0 0 N041 0 0 BUF
XU3 N095 0 V5+ 0 N099 level3a  ; pins In+ In- V+ V- OUT
R3 N099 P003 1kΩ
D3 P003 0 AOT-2015
.model D D
.lib standard.dio
* EBA196h.asc: Radyo frekans ve dijital elektronik devreleri-6h örneği.
* 6.3 • İkili sayılarda dört işlem yapan devrelere aritmetik mantık devreleri denir. Toplayıcı devreleri, bir bitlik A ve B gibi ikilik
*     sayıları toplayarak çıkışa mantık olarak aktaran devrelerdir. İkilik sayıları toplarken boolean ifadelerindeki kurallar geçerlidir.
*     0+0=0, 0+1=1, 1+0=1, 1+1=10 (Yekun=0, Taşan=1). Yarım toplayıcıda girişindeki bir bitlik iki sayıyı (A+B)  toplar ve çıkış-
*     ta yekun YS) ve elde (E) olmak üzere iki çıkışı vardır. Yarım toplayıcılarda elde girişi yoktur. Sağdaki A1-A6 devre.
*     Girişindeki bir bitlik üç sayıyı toplayan devreye tam toplayıcı denir. Yarım toplayıcıdan farkı elde girişinin olmasıdır. Bu devre
*     iki yarım toplayıcı ve bir OR kapısından oluşur. Sağda tam toplayının doğruluk ve mantık devresi verilmiştir.
*     • Çıkarıcı devreleri, A ve B gibi bir bitlik ikilik sayıların farkını alarak çıkışa mantık olarak aktaran devrelerdir. İkili sayıların
*     farkını alırken boolean ifadelerindeki kurallar geçerlidir. 0-0=0, 1-0=1, 1-1=0 0-1=1 (Borç=1, Fark=1). Sağdaki A18 mantık
*     devresi yarım çıkarıcı içindir. Sağdaki A11'de tam çıkarıcı doğruluk ve devre görülmektedir.
*     • Karşılaştırıcı  devre iki sayıyı mantık olarak büyük (>), eşit (=) veya küçük sonuçları doğru/true=1 yada yanlış/false=0.
*     Sağda A22 devrede iki bitlik karşılaştırıcı mantık ve doğruluk test edilebilir.
*     • Temrin-89: Sağdaki A27, 8'er bitlik tam toplayıcı 0+0=0--->11111111(255) + 11111111(255)=510=254+256 toplama
*     yapar. Örnekte 185+110=295=39+256: 10011101+01110110=11100100-1 test edilmiştir.
*     • Temrin-90: Alttaki U1-İşYük mantık devresi 4'er bitlik 0000-->1111: 0-->15 sayılarının karşılaştırmasının doğruluk tablo-
*     sunu ve mantık-İşYük-LED devresini A>B için AND-OR, A=B için XNOR-AND ve A<B için AND-OR kapı devresini 1001(9)
*     =1001(9), 1001(9)>1000(8), 1000(8)<1001(9) testinde doğru sonuç Iled=(5V-2.46V)/1kΩ=2.54mA, LED yanar.
;tran 0 1mS startup
* Doğruluk
* A B  Y E
* 0 0   0 0
* 0 1   1 0
* 1 0   1 0
* 1 1   0 1
* A
* B
* Y
* E
* Mantık devre
* YARIM TOPLAYICI
* Doğruluk
* A B Eg Eç Y
* 0 0  0   0  0-->0
* 0 0  1   0  1-->1
* 0 1  0   0  1-->1
* 0 1  1   1  0-->2
* 1 0  0   0  1-->1
* 1 0  1   1  0-->2
* 1 1  0   1  0-->2
* 1 1  1   1  1-->3
* Y
* Mantık devre
* TAM TOPLAYICI
* A
* B
* Eg
* Eç
* Doğruluk
* A B  Y E
* 0 0   0 0
* 0 1   1 1
* 1 0   1 0
* 1 1   0 0
* Mantık devre
* YARIM ÇIKARICI
* A
* B
* Y
* E
* Doğruluk
* A B Eg Eç Y
* 0 0  0   0  0
* 0 0  1   1  1
* 0 1  0   1  1
* 0 1  1   0  1
* 1 0  0   1  0
* 1 0  1   0  0
* 1 1  0   0  0
* 1 1  1   1  1
* Y
* Mantık devre
* TAM ÇIKARICI
* A
* B
* Eg
* Eç
* Doğruluk
* Giriş Çıkışlar
* A B A>B A=B A<B
* 0 0    0      1      0
* 0 1    0      0      1
* 1 0    1      0      0
* 1 1    0      1      0
* Mantık devre
* İKİ BİTLİ KARŞILAŞTIRICI
* A
* B
* A=B
* A>B
* A<B
* XNOR
* Y0
* A0
* B0
* Eg
* Eç
* Y1
* A1
* B1
* Eg
* Eç
* Y2
* A2
* B2
* Eg
* Eç
* Y3
* A3
* B3
* Eg
* Eç
* Y4
* A4
* B4
* Eg
* Eç
* Y5
* A5
* B5
* Eg
* Eç
* Y6
* A6
* B6
* Eg
* Eç
* Y7
* A7
* B7
* Eg
* Eç
* 2^0=1
* 2^1=2
* 2^2=4
* 2^3=8
* 2^4=16
* 2^5=32
* 2^6=64
* 2^7=128
* 2^08=256
* 1
* 2
* 4
* 8
* 16
* 32
* 64
* 128
* Örn.185+110=295=39+256
* (1+0+0+8+16+32+0+128)+(0+2+4+8+0+32+64+0)=(1+2+4+0+0+32+0+0)+256
* 10011101+01110110=11100100-1
* 1
* 0
* 0
* 1
* 1
* 0
* 0
* 1
* 1
* Doğruluk
* Girişler                                 Çıkışlar
* A3,B3 A2,B2 A1,B1 A0,B0   A>B A=B A<B
* A3>B3    X        X        X          1      0      0
* A3<B3    X        X        X          0      0      1
* A3=B3 A2>B2  X        X          1      0      1
* A3=B3 A2<B2  X        X          0      0      1
* A3=B3 A2=B2 A1>B1 X         1      0      0
* A3=B3 A2=B2 A1<B1 X         0      0      1
* A3=B3 A2=B2 A1=B1 A0>B0 1      0      0
* A3=B3 A2=B2 A1=B1 A0<B0 0      0      1
* A3=B3 A2=B2 A1=B1 A0=B0 0      1      0
* A2
* A1
* A0
* B3
* B2
* B1
* B0
* A=B=(A3xB3)'(A2xB2)'(A1xB1)'(A0xB0)'
* A>B=A3B3'+A2B2'A3B3+A1B1'A3B3A2B2+A0B0'A3B3A2B2A1B1
* A<B=A3'B3+A2'B2A3B3+A1'B1A3B3A2B2+A0'B0A3B3A2B2A1B1
* A=A3A2A1A0
* B=B3B2B1B0
* A3
.tran 0 100uS startup
.backanno
.end